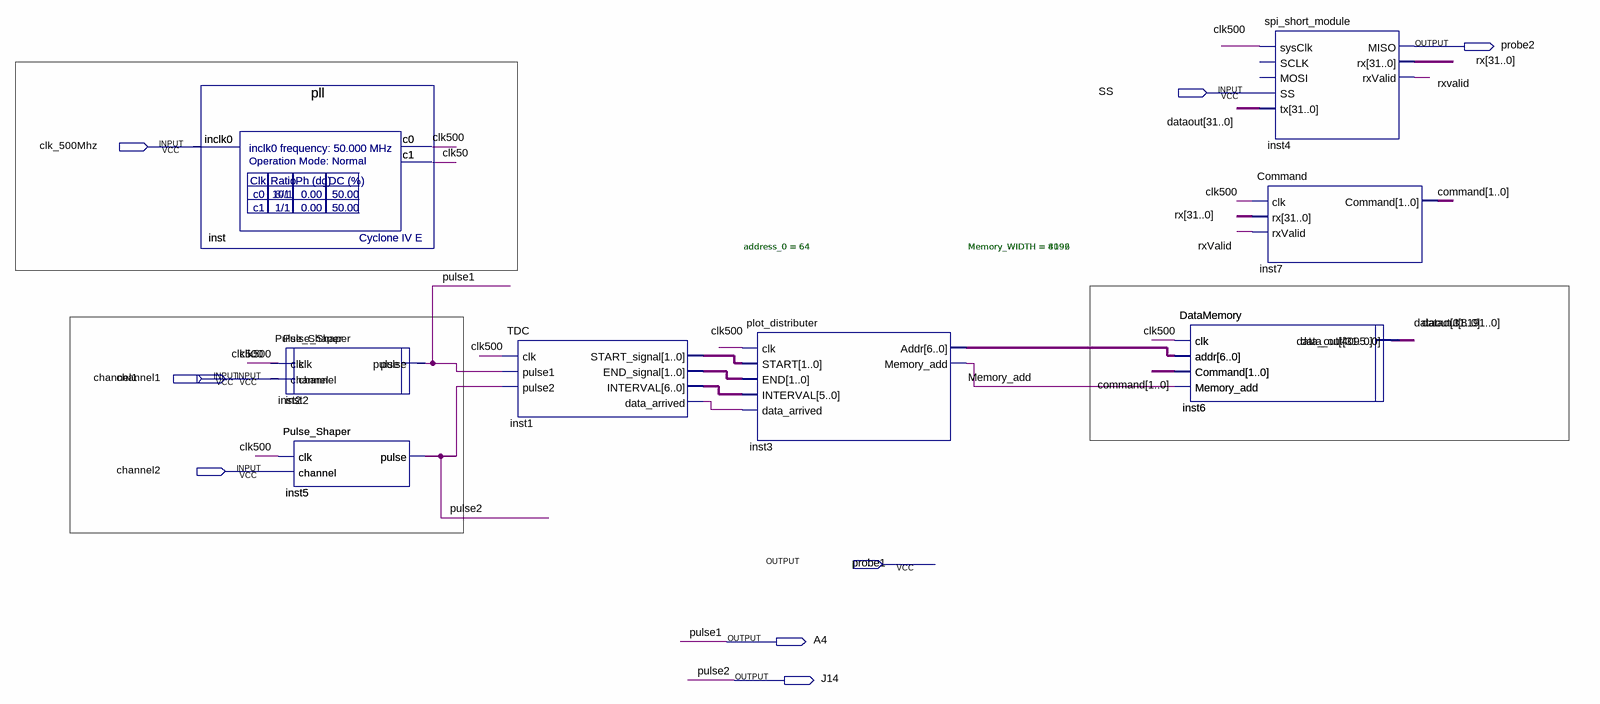
[diagram p0: schematic sheet]
// Quartus schematic r_TCA.bdf as structural Verilog: 12 symbols, 9 pins
module r_TCA (
  input  SS,
  input  clk_500Mhz,
  input  channel1,
  input  channel2,
  output probe2,
  output probe1,
  output A4,
  output J14
);

  wire clk50, clk500, inst1_data_arrived, Memory_add, rxValid;
  wire [1:0] command, inst1_end_signal, inst1_start_signal;
  wire [5:0] inst1_interval;
  wire [6:0] inst3_addr;
  wire [31:0] dataout, rx;
  wire [4095:0] inst6_data_out;

  pll inst (.inclk0(clk_500Mhz), .c0(clk500), .c1(clk50));
  pll inst_dup2 (.inclk0(clk_500Mhz), .c0(clk500), .c1(clk50));
  Pulse_Shaper inst2 (.clk(clk500), .channel(channel1), .pulse(A4));
  Pulse_Shaper inst2_dup2 (.clk(clk500), .channel(channel1), .pulse(A4));
  Pulse_Shaper inst5 (.clk(clk500), .channel(channel2), .pulse(J14));
  Pulse_Shaper inst5_dup2 (.clk(clk500), .channel(channel2), .pulse(J14));
  TDC inst1 (
    .clk(clk500), .pulse1(A4), .pulse2(J14), .START_signal(inst1_start_signal),
    .END_signal(inst1_end_signal), .INTERVAL(inst1_interval), .data_arrived(inst1_data_arrived));
  plot_distributer #(.address_0(64)) inst3 (
    .clk(clk500), .START(inst1_start_signal), .END(inst1_end_signal), .INTERVAL(inst1_interval),
    .data_arrived(inst1_data_arrived), .Addr(inst3_addr), .Memory_add(Memory_add));
  DataMemory #(.Memory_WIDTH(4096)) inst6 (
    .clk(clk500), .addr(inst3_addr), .Command(command), .Memory_add(Memory_add), .data_out(dataout));
  DataMemory #(.Memory_WIDTH(8192)) inst6_dup2 (
    .clk(clk500), .addr(inst3_addr), .Command(command), .Memory_add(Memory_add), .data_out(inst6_data_out));
  spi_short_module inst4 (
    .sysClk(clk500), .SS(SS), .tx(dataout), .MISO(probe2), .rx(rx), .rxValid(rxValid));  // open: SCLK, MOSI
  Command inst7 (.clk(clk500), .rx(rx), .rxValid(rxValid), .Command(command));

  // Other names for the same wires on the sheet: pulse1 = A4; pulse2 = J14
endmodule
